# EAGLE design gpst_a (EAGLE 6.5.0)
REVISION: A; TITLE: sEHnsor
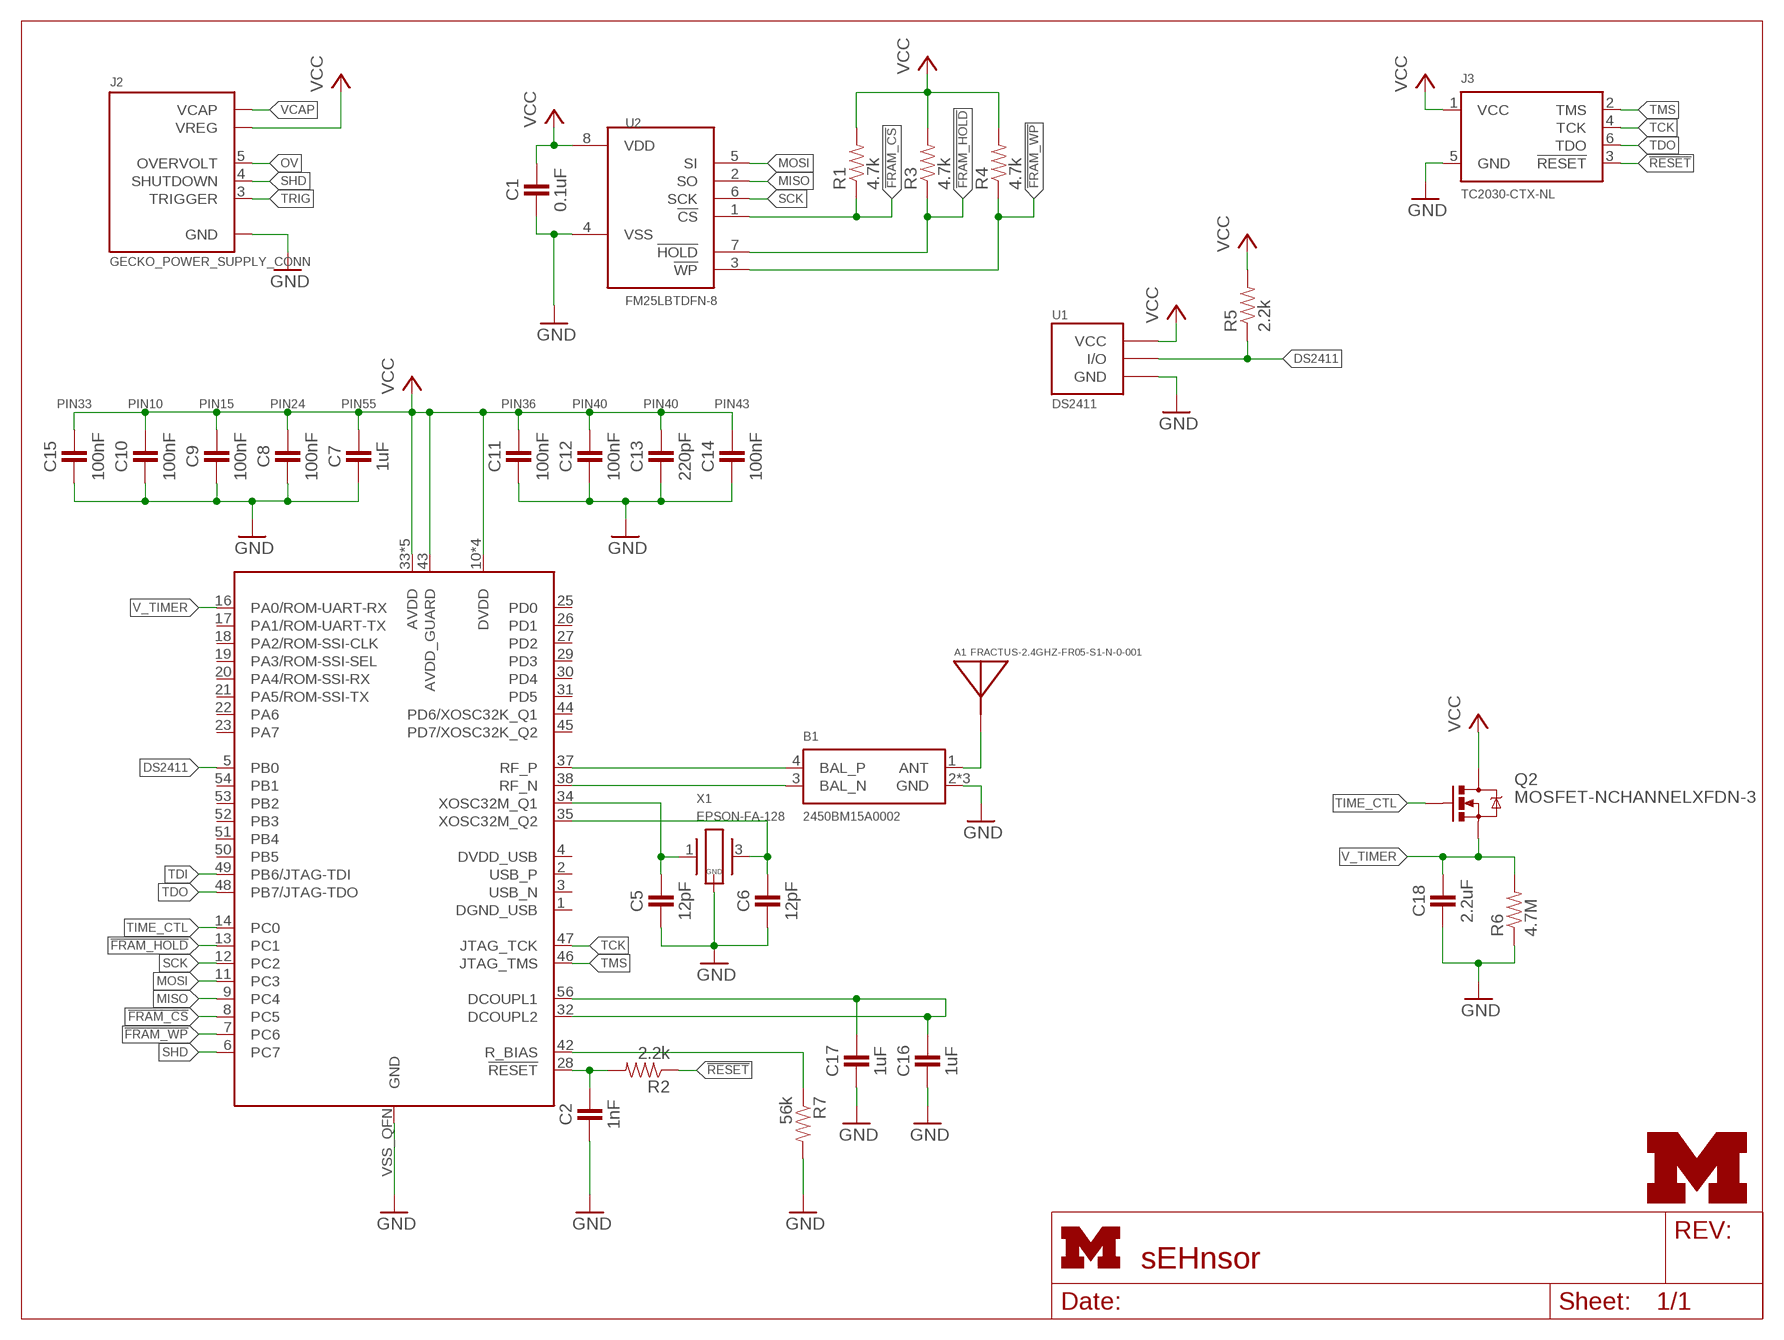
[diagram p0: schematic, sheet 1]
FRAME1 (LETTER_L): HEIGHT: 8.5in; WIDTH: 11in

## Parts
A1  FRACTUS-2.4GHZ-FR05-S1-N-0-001  [FRACTUS-ANTENNA-FR05-S1-N-0-001]
B1  2450BM15A0002  [2450BM]
C1  0.1uF  CAPACITOR  [0402_CAP]
C2  1nF  CAPACITOR  [0402_CAP]
C5  12pF  CAPACITOR  [0402_CAP]
C6  12pF  CAPACITOR  [0402_CAP]
C7  1uF  CAPACITOR  [0402_CAP]
C8  100nF  CAPACITOR  [0402_CAP]
C9  100nF  CAPACITOR  [0402_CAP]
C10  100nF  CAPACITOR  [0402_CAP]
C11  100nF  CAPACITOR  [0402_CAP]
C12  100nF  CAPACITOR  [0402_CAP]
C13  220pF  CAPACITOR  [0402_CAP]
C14  100nF  CAPACITOR  [0402_CAP]
C15  100nF  CAPACITOR  [0402_CAP]
C16  1uF  CAPACITOR  [0402_CAP]
C17  1uF  CAPACITOR  [0402_CAP]
C18  2.2uF  CAPACITOR  [0402_CAP]
J2  GECKO_POWER_SUPPLY_CONN  [HEADER1X6/0.05IN]
J3  TC2030-CTX-NL  [TC2030-IDC-NL]
Q2  MOSFET-NCHANNELXFDN-3  [XFDFN-3]
R1  4.7k  RESISTOR  [0402_RES]
R2  2.2k  RESISTOR  [0402_RES]
R3  4.7k  RESISTOR  [0402_RES]
R4  4.7k  RESISTOR  [0402_RES]
R5  2.2k  RESISTOR  [0402_RES]
R6  4.7M  RESISTOR  [0402_RES]
R7  56k  RESISTOR  [0402_RES]
U1  DS2411  [SOT-23]
U2  FM25LBTDFN-8  [TDFN-8]
U4  CC2538  [S-PVQFN-N56]
U$1  UMICH_SOLID_SMALL  [UMICH_SOLID_75MIL]
X1  EPSON-FA-128  [FA-128]

## Nets
!FRAM_CS: R1.1 U2.1(!CS) U4.8(PC5)
!FRAM_HOLD: R3.1 U2.7(!HOLD) U4.13(PC1)
!FRAM_WP: R4.1 U2.3(!WP) U4.7(PC6)
!RESET: J3.3(!RESET) R2.1
ANTENNA: A1.1(ANTENNA) B1.1(ANT)
DS2411: R5.1 U1.1(I/O) U4.5(PB0)
GND: B1.2(GND) B1.5(GND) B1.6(GND) C1.2 C2.2 C5.2 C6.2 C7.2 C8.2 C9.2 C10.2 C11.2 C12.2 C13.2 C14.2 C15.2 C16.2 C17.2 C18.2 J2.1(GND) J3.5(GND) R6.1 R7.2 U1.3(GND) U2.4(VSS) U4.VSS_QFN(GND) X1.2(GND) X1.4(GND)
MISO: U2.2(SO) U4.9(PC4)
MOSI: U2.5(SI) U4.11(PC3)
N$1: C2.1 R2.2 U4.28(!RESET)
N$8: R7.1 U4.42(R_BIAS)
N$9: C5.1 U4.34(XOSC32M_Q1) X1.1
N$10: C6.1 U4.35(XOSC32M_Q2) X1.3
N$15: C16.1 C17.1 U4.32(DCOUPL2) U4.56(DCOUPL1)
OV: J2.5(OVERVOLT)
RF_N: B1.3(BAL_N) U4.38(RF_N)
RF_P: B1.4(BAL_P) U4.37(RF_P)
SCK: U2.6(SCK) U4.12(PC2)
SHD: J2.4(SHUTDOWN) U4.6(PC7)
TCK: J3.4(TCK) U4.47(JTAG_TCK)
TDI: U4.49(PB6/JTAG-TDI)
TDO: J3.6(TDO) U4.48(PB7/JTAG-TDO)
TIME_CTL: Q2.G U4.14(PC0)
TMS: J3.2(TMS) U4.46(JTAG_TMS)
TRIG: J2.3(TRIGGER)
V_TIMER: C18.1 Q2.S R6.2 U4.16(PA0/ROM-UART-RX)
VCAP: J2.6(VCAP)
VCC: C1.1 C7.1 C8.1 C9.1 C10.1 C11.1 C12.1 C13.1 C14.1 C15.1 J2.2(VREG) J3.1(VCC) Q2.D R1.2 R3.2 R4.2 R5.2 U1.2(VCC) U2.8(VDD) U4.10(DVDD) U4.15(DVDD) U4.24(DVDD) U4.33(AVDD) U4.36(AVDD) U4.39(AVDD) U4.40(AVDD) U4.41(AVDD) U4.43(AVDD_GUARD) U4.55(DVDD)
Unconnected: U4.1(DGND_USB) U4.2(USB_P) U4.3(USB_N) U4.4(DVDD_USB) U4.17(PA1/ROM-UART-TX) U4.18(PA2/ROM-SSI-CLK) U4.19(PA3/ROM-SSI-SEL) U4.20(PA4/ROM-SSI-RX) U4.21(PA5/ROM-SSI-TX) U4.22(PA6) U4.23(PA7) U4.25(PD0) U4.26(PD1) U4.27(PD2) U4.29(PD3) U4.30(PD4) U4.31(PD5) U4.44(PD6/XOSC32K_Q1) U4.45(PD7/XOSC32K_Q2) U4.50(PB5) U4.51(PB4) U4.52(PB3) U4.53(PB2) U4.54(PB1)

## Notes on the sheet
- PIN33 | PIN10 | PIN15 | PIN24 | PIN55 | PIN36 | PIN40 | PIN40 | PIN43

## Library data of the parts
A1 = chips:FRACTUS-2.4GHZ-FR05-S1-N-0-001: Fractus Reach Xtend Bluetooth®, Zigbee®, 802.11 b/g/n WLAN Chip Antenna
B1 = chips:2450BM15A0002: BALUN JTI MATCHED ZIGBEE; DIGIKEY: 712-1536-1-ND
C1 C2 C5-C18 = passives:CAPACITOR: 0402 Capacitor
J2 = gecko:GECKO_POWER_SUPPLY_CONN: Header on the gecko power supply board.
J3 = connector:TC2030-CTX: Tag Connect footprint for ARM JTAG. 10 pin ARM Cortex Debug Connector.
Q2 = fets:MOSFET-NCHANNEL: Generic NMOS footprint; DIGIKEY: DMN2400UFB4-7DICT-ND
R1-R7 = passives:RESISTOR: Resistor Basic schematic elements and footprints for 0603, 1206, and PTH resistors.
U1 = chips:DS2411: Maxim DS2411 Silicon Serial Number with VCC Input; DIGIKEY: DS2411R+CT-ND
U2 = chips:FM25LB: IC FRAM 4KBIT 10MHZ 8SOIC; DIGIKEY: FM25L04B-DGRA-ND; MOUSER: 877-FM25L04B-DG
U4 = chips:CC2538: A Powerful System-On-Chip for 2.4-GHz IEEE 802.15.4, 6LoWPAN and ZigBee Applications; DIGIKEY: 296-35797-1-ND; MOUSER: 595-CC2538SF53RTQT; NEWARK: 87W7713
U$1 = logos:UMICH_SOLID
X1 = crystals:EPSON-FA-128: MHz RANGE CRYSTAL UNIT ULTRA MINIATURE SIZE LOW PROFILE SMD http://www.digikey.com/product-search/en?FV=ffec63d1

## Board
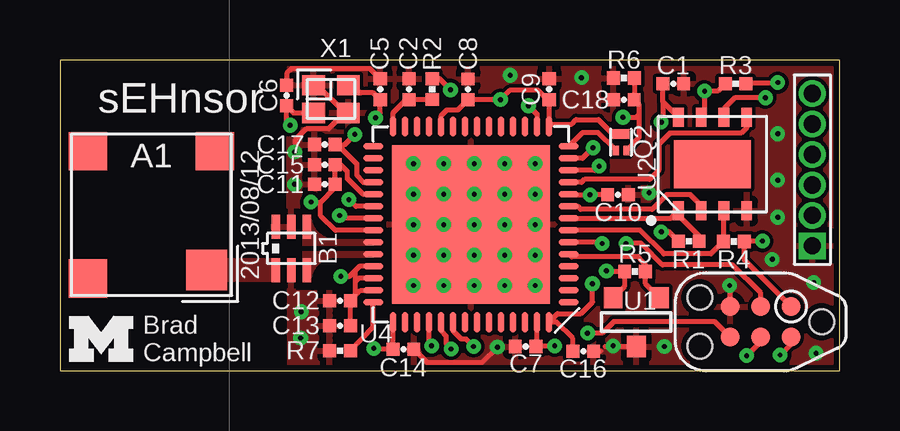
[diagram p1: board, top side]
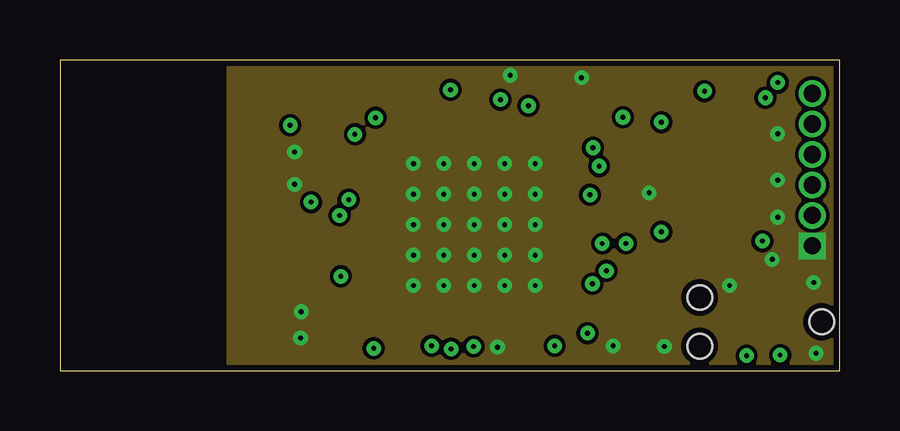
[diagram p2: board, inner layer Route2]
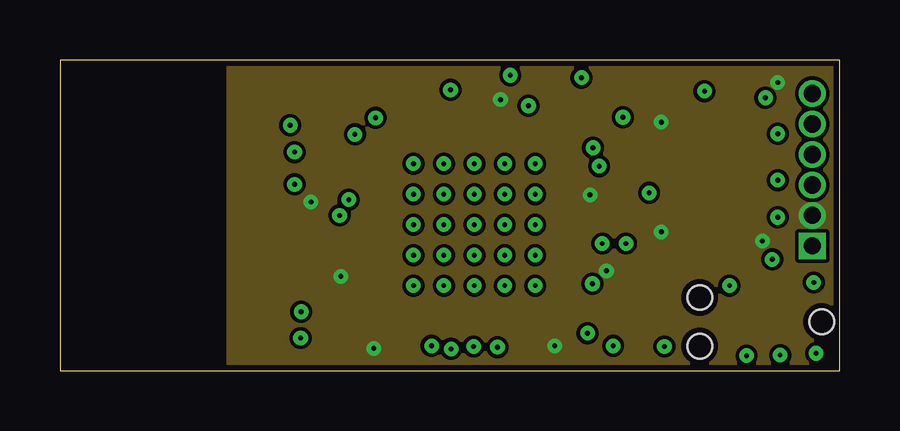
[diagram p3: board, inner layer Route15]
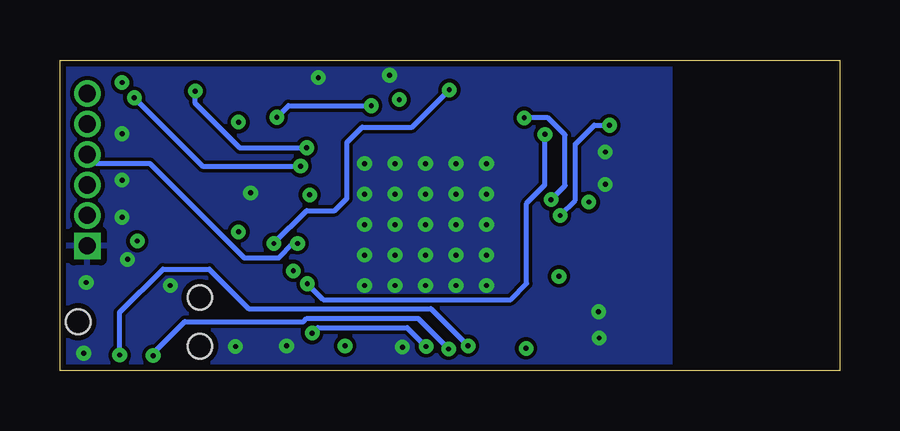
[diagram p4: board, bottom side, seen from below]

Size 32.51 x 12.95 mm. Coordinates in mm from the lower left corner, seen from the top.
Outline: 0,0 32.51,0 32.51,12.95 0,12.95 0,0
Copper layers (1+2*15+16): Top 0.0178mm / dielectric 12mil / Route2 0.0356mm / dielectric 28mil / Route15 0.0356mm / dielectric 12mil / Bottom 0.0178mm
Design rules "sunstone-4lyr_v1.0.0.3 *": minimum track width 6mil, minimum drill 8mil, track to track 6mil, track to pad 6mil, pad to pad 6mil, via to via 6mil, smd to smd 6mil, copper to edge 10mil, drill to drill 16mil, minimum pad ring 8mil, minimum via ring 8mil, stop-mask expansion 3mil, vias tented up to drill 8mil, thermal gap 10mil

### Footprints (pad centres in the part's own frame; a part is rotated, then mirrored left to right if it is on the bottom)
FRACTUS-ANTENNA-FR05-S1-N-0-001 = smd 1.7 x 1.7: 1 2.3,-2.3 | smd 1.6 x 1.6: 2 2.65,2.65; 3 -2.65,-2.65; 4 -2.65,2.65
2450BM = smd 0.35 x 1: 1 0.65,0.9; 2 0,0.9; 3 -0.65,0.9; 4 -0.65,-0.9; 5 0,-0.9; 6 0.65,-0.9
0402_CAP = smd 0.536 x 0.546: 1 -0.433,0; 2 0.433,0
HEADER1X6/0.05IN = drill 0.711 pad 1.016 square: 1 -2.54,0 | drill 0.711 pad 1.016: 2 -1.27,0; 3 0,0; 4 1.27,0; 5 2.54,0; 6 3.81,0
TC2030-IDC-NL = smd 0.787 x 0.787: 1 -1.27,-0.635; 2 -1.27,0.635; 3 0,-0.635; 4 0,0.635; 5 1.27,-0.635; 6 1.27,0.635 | hole 1.016: -2.54,0; 2.54,1.016; 2.54,-1.016
XFDFN-3 = smd 0.4 x 0.7: D 0.35,0 | smd 0.4 x 0.25: G -0.35,0.215; S -0.35,-0.215
0402_RES = smd 0.536 x 0.546: 1 -0.433,0; 2 0.433,0
SOT-23 = smd 0.787 x 0.889: 1 0.991,1.016; 2 -0.94,1.016; 3 0.025,-1.016
TDFN-8 = smd 0.45 x 0.8: 1 -1.425,-1.95; 2 -0.475,-1.95; 3 0.475,-1.95; 4 1.425,-1.95; 5 1.425,1.95; 6 0.475,1.95; 7 -0.475,1.95; 8 -1.425,1.95 | smd 3.2 x 2: NC 0,0
S-PVQFN-N56 = smd 0.85 x 0.28: 1 -4.075,3.25; 2 -4.075,2.75; 3 -4.075,2.25; 4 -4.075,1.75; 5 -4.075,1.25; 6 -4.075,0.75; 7 -4.075,0.25; 8 -4.075,-0.25; 9 -4.075,-0.75; 10 -4.075,-1.25; 11 -4.075,-1.75; 12 -4.075,-2.25; 13 -4.075,-2.75; 14 -4.075,-3.25; 29 4.075,-3.25; 30 4.075,-2.75; 31 4.075,-2.25; 32 4.075,-1.75; 33 4.075,-1.25; 34 4.075,-0.75; 35 4.075,-0.25; 36 4.075,0.25; 37 4.075,0.75; 38 4.075,1.25; 39 4.075,1.75; 40 4.075,2.25; 41 4.075,2.75; 42 4.075,3.25 | smd 0.28 x 0.85: 15 -3.25,-4.075; 16 -2.75,-4.075; 17 -2.25,-4.075; 18 -1.75,-4.075; 19 -1.25,-4.075; 20 -0.75,-4.075; 21 -0.25,-4.075; 22 0.25,-4.075; 23 0.75,-4.075; 24 1.25,-4.075; 25 1.75,-4.075; 26 2.25,-4.075; 27 2.75,-4.075; 28 3.25,-4.075; 43 3.25,4.075; 44 2.75,4.075; 45 2.25,4.075; 46 1.75,4.075; 47 1.25,4.075; 48 0.75,4.075; 49 0.25,4.075; 50 -0.25,4.075; 51 -0.75,4.075; 52 -1.25,4.075; 53 -1.75,4.075; 54 -2.25,4.075; 55 -2.75,4.075; 56 -3.25,4.075 | smd 6.6 x 6.6: VSS_QFN 0,0
FA-128 = smd 0.95 x 0.85: 1 -0.725,-0.575; 2 0.725,-0.575; 3 0.725,0.575; 4 -0.725,0.575

### Placement (x,y rotation side)
A1  3.81,6.5 0 top
B1  9.64,5.1 180 top
C1  25.57,11.97 0 top
C2  14.55,11.73 90 top
C5  13.35,11.73 90 top
C6  9.45,11.47 90 top
C7  19.41,1.02 180 top
C8  17.02,11.73 90 top
C9  20.4,11.73 90 top
C10  23.27,7.33 0 top
C11  11.04,7.78 180 top
C12  11.68,2.93 180 top
C13  11.68,1.89 180 top
C14  14.32,0.9 0 top
C15  11.04,8.59 180 top
C16  21.82,0.82 0 top
C17  11.04,9.43 180 top
C18  23.51,11.3 180 top
J2  31.37,7.75 90 top
J3  29.21,2.05 180 top
Q2  23.39,9.53 90 top
R1  26.21,5.4 180 top
R2  15.52,11.74 270 top
R3  28.17,11.97 0 top
R4  28.09,5.39 0 top
R5  23.98,4.14 180 top
R6  23.51,12.2 0 top
R7  11.68,0.85 180 top
U1  24,2.03 0 top
U2  27.2,8.62 0 top
U4  17.14,6.1 180 top
U$1  0.38,0.38 0 top
X1  11.3,11.33 180 top

### Tracks (layer width: path | path; a pad name or v marks a point on that pad's centre or on a via)
!FRAM_CS
  Top 0.203: U4.8 25.46,6.35 U2.1 25.78,6.48 26.65,5.61 R1.1
!FRAM_HOLD  (via drill 0.2)
  Top 0.203: R3.1 27.42,11.66 v26.87,11.66 26.87,10.71 U2.7 | v22.23,9.3 21.78,8.85 U4.13
  Bottom 0.203: v22.23,9.3 25.02,9.3 26.87,11.15 v26.87,11.66
!FRAM_WP
  Top 0.203: U2.3 27.66,6.65 R4.1 27.14,4.88 25.17,4.88 24.18,5.87 21.23,5.87 U4.7
!RESET  (via drill 0.2)
  Top 0.203: J3.3 29.21,3.25 28.04,4.42 25.12,4.42 24.23,5.31 v23.6,5.31 | v16.28,11.71 15.82,12.18 R2.1
  Bottom 0.203: v23.6,5.31 22.23,6.68 21.06,6.68 20.55,7.19 20.55,9.53 19.91,10.16 17.83,10.16 v16.28,11.71
ANTENNA
  Top 0.406: 6.36,4.19 A1.1
  pour Top (no thermals): 6.35,3.72 9.14,3.72 9.12,4.69 6.32,4.69
DS2411
  Top 0.203: U1.1 24.41,3.63 R5.1 24.41,4.42 24.11,4.75 21.34,4.75 U4.5
GND  (via drill 0.2)
  Top 0.203: X1.2 10.73,11.9 11.88,10.75 | 11.88,10.75 X1.4 | U1.3 22.73,1.02 | C16.2 22.54,0.82 | C14.2 15.29,0.36 17.6,0.36 v18.24,0.99 | J3.5 27.95,3.53 v27.91,3.56 | C5.2 12.92,12.6 9.65,12.6 9.45,12.39 C6.2 | 11.88,10.75 11.87,10.75 11.2,10.08 10.26,10.08 9.8,9.63 9.8,9.12 9.78,9.09
  other vias: 16,8.64 17.27,7.37 18.54,7.37 18.54,6.1 17.27,6.1 16,6.1 16,4.83 17.27,4.83 18.54,4.83 23.06,1.04 25.2,1.02 29.92,9.88 21.74,12.22 18.77,12.32 24.56,7.42 31.42,3.68 29.69,4.65 31.52,0.74 16,7.37 14.73,7.37 17.27,8.64 14.73,6.1 14.73,4.83 16,3.56 17.27,3.56 18.54,3.56 19.81,4.83 19.81,6.1 19.81,7.37 18.54,8.64 14.73,8.64 19.81,8.64 19.81,3.56 14.73,3.56 29.92,7.95 10.06,2.46 10.03,1.37 29.92,6.4 9.78,9.12 9.78,7.77
  pour Top: 9.58,13.72 33.02,13.72 33.02,-0.51 9.58,-0.51 9.58,4.6 9.73,4.6 9.73,3.28 13.72,3.3 13.72,6.86 9.73,6.86 9.73,5.61 8.92,5.61 8.92,6.4 9.55,6.4
  pour Bottom: 7.06,13.72 33.02,13.72 33.02,-0.51 7.06,-0.51
  pour Route2 (no thermals): 7.06,14.22 33.53,14.22 33.53,-1.02 7.06,-1.02
MISO
  Top 0.203: U2.2 26.73,6.9 26.29,7.34 25.3,7.34 24.69,6.73 21.72,6.73 21.59,6.86 U4.9
MOSI
  Top 0.203: U2.5 28.63,10.14 28.4,9.91 25.43,9.91 24.97,9.45 24.97,8.36 24.59,7.98 21.87,7.98 21.75,7.85 U4.11
N$1
  Top 0.203: U4.28 13.89,10.76 14.42,11.3 C2.1 R2.2
N$8
  Top 0.203: R7.1 13.06,1.81 U4.42
N$9  (via drill 0.2)
  Top 0.203: v13.16,10.54 13.35,10.74 C5.1 13.06,11.58 12.55,11.58 X1.1 | U4.34 12.32,6.85 v12.04,7.14
  Bottom 0.203: v13.16,10.54 12.17,10.54 11.46,9.83 11.46,7.72 v12.04,7.14
N$10  (via drill 0.2)
  Top 0.203: 10.67,10.66 X1.3 9.74,10.75 C6.1 9.45,10.39 v9.6,10.24 | U4.35 11.78,6.35 v11.66,6.48
  Bottom 0.203: v9.6,10.24 10.24,10.24 11.02,9.45 11.02,7.37 11.02,7.16 11.02,7.11 v11.66,6.48
N$15  (via drill 0.2)
  Top 0.203: U4.32 12.64,7.85 12.37,8.15 12.37,8.64 11.58,9.43 C17.1 11.87,9.43 v12.29,9.86 | v22.2,3.63 22.2,2.87 21.72,2.39 20.75,2.39 U4.56 20.7,2.03 21.38,1.35 C16.1
  Bottom 0.203: v12.29,9.86 12.29,7.75 13.06,6.99 13.06,3.63 13.72,2.97 21.54,2.97 v22.2,3.63
RF_N
  pour Top (no thermals): 13.08,4.99 10.12,4.99 10.12,3.7 10.47,3.7 arc-90 11.5,4.71 13.08,4.71
RF_P
  pour Top (no thermals): 13.08,5.21 10.12,5.21 10.12,6.5 10.47,6.5 arc90 11.5,5.49 13.08,5.49
SCK  (via drill 0.2)
  Top 0.203: 27.68,10.89 U2.6 27.68,10.91 28.14,11.38 v29.41,11.38 | v22.48,8.53 22.3,8.35 U4.12
  Bottom 0.203: v29.41,11.38 26.57,8.53 v22.48,8.53
SHD  (via drill 0.2)
  Top 0.203: v22.61,5.31 22.56,5.35 U4.6
  Bottom 0.203: v22.61,5.31 22.78,5.31 23.39,4.7 24.82,4.7 28.75,8.64 30.99,8.64 J2.4
TCK  (via drill 0.2)
  Top 0.203: U4.47 15.89,1.66 16.1,1.45 16.1,1.12 v16.31,0.91 | J3.4 29.21,1.22 v28.63,0.64
  Bottom 0.203: v28.63,0.64 28.63,0.74 27.3,2.06 22.35,2.06 22.23,2.18 17.58,2.18 v16.31,0.91
TDO  (via drill 0.2)
  Top 0.203: 16.39,1.82 U4.48 | J3.6 27.3,2.06 23.09,2.06 22.61,1.57 v22,1.57 | 16.39,1.75 U4.48 | v17.25,1.02 16.94,1.32 16.74,1.32 16.39,1.67 U4.48
  Bottom 0.203: v17.25,1.02 18.03,1.8 21.77,1.8 v22,1.57
TIME_CTL
  Top 0.203: U4.14 21.79,9.93 22.43,9.93 23.15,9.21 23.18,9.21 Q2.G
TMS  (via drill 0.2)
  Top 0.203: v15.49,1.04 15.39,1.2 U4.46 | J3.2 30.48,1.12 v30.02,0.66
  Bottom 0.203: v30.02,0.66 30.02,2.44 28.22,4.24 26.29,4.24 24.64,2.59 17.04,2.59 v15.49,1.04
V_TIMER  (via drill 0.2)
  Top 0.203: R6.2 C18.1 24.16,11.09 24.16,10.69 | Q2.S 24.16,9.73 24.16,10.69 | v23.47,10.57 24.03,10.57 24.16,10.69 | v19.53,11.05 19.89,10.7 U4.16
  Bottom 0.203: v23.47,10.57 22.99,11.05 v19.53,11.05
VCC  (via drill 0.2)
  Top 0.203: U4.10 21.23,7.33 v22.1,7.33 C10.1 | U2.8 25.13,11.21 | 25.13,11.21 C1.1 | U1.2 23.54,3.53 R5.2 22.81,4.14 v22.78,4.17 | U4.43 13.89,0.92 C14.1 13.12,0.9 v13.08,0.94 | C12.1 12.53,3.35 U4.41 | C13.1 C12.1 | 20.39,11.29 U4.15 20.5,10.29 21.34,10.29 21.51,10.46 22.45,10.46 23.04,9.88 Q2.D | U4.39 12.48,4.35 12.31,4.18 | 12.31,4.18 12.31,3.71 | 12.31,3.71 12.31,3.13 C12.1 | 20.39,11.29 C9.1 | C7.1 19.89,1.05 | 19.89,1.05 U4.55 | U4.24 15.89,10.63 16.13,10.87 16.59,10.87 C8.1 v18.36,11.3 18.75,11.68 19.94,11.68 20.33,11.29 20.39,11.29 | U4.40 12.45,3.85 12.31,3.71 | v11.71,3.94 12.06,3.94 12.31,4.18 | C11.1 C15.1 11.7,8.59 11.99,8.31 11.99,8 12.64,7.35 U4.33 | v10.46,7.04 10.88,7.04 | 11.33,7.63 C11.1 | 10.88,7.04 11.47,7.63 C11.1 | J3.1 28.52,4.64 R4.2 28.54,5.41 v29.29,5.41 | R3.2 28.64,12.01 v29.92,12.01 | 19.89,1.05 19.9,1.04 v20.62,1.04 | R1.2 25.39,5.79 v25.07,5.79 | U4.36 11.47,5.85 10.87,6.45 10.87,7.03 10.88,7.04 | 25.13,11.21 25.13,10.43 v25.07,10.36
  pour Route15 (no thermals): 7.06,13.72 33.53,13.72 33.53,-1.02 7.06,-1.02

### Text on the board
tPlace: sEHnsor | 2013/08/12 | Brad / Campbell